# Altium schematic sheet 2414-SPB7_Connectors.SchDoc: =SchTitle
size 276 x 198 mm; Organization: ETML-ES; Address1: Rue de Sébeillon12; Address2: CH - 1004 Lausanne; Address3: Tél. 021 316 77 77; Address4: www.etml-es.ch; SheetNumber: 3; SheetTotal: 4; Replace: .; ModA: .; ModB: .; ModC: .; ModD: .
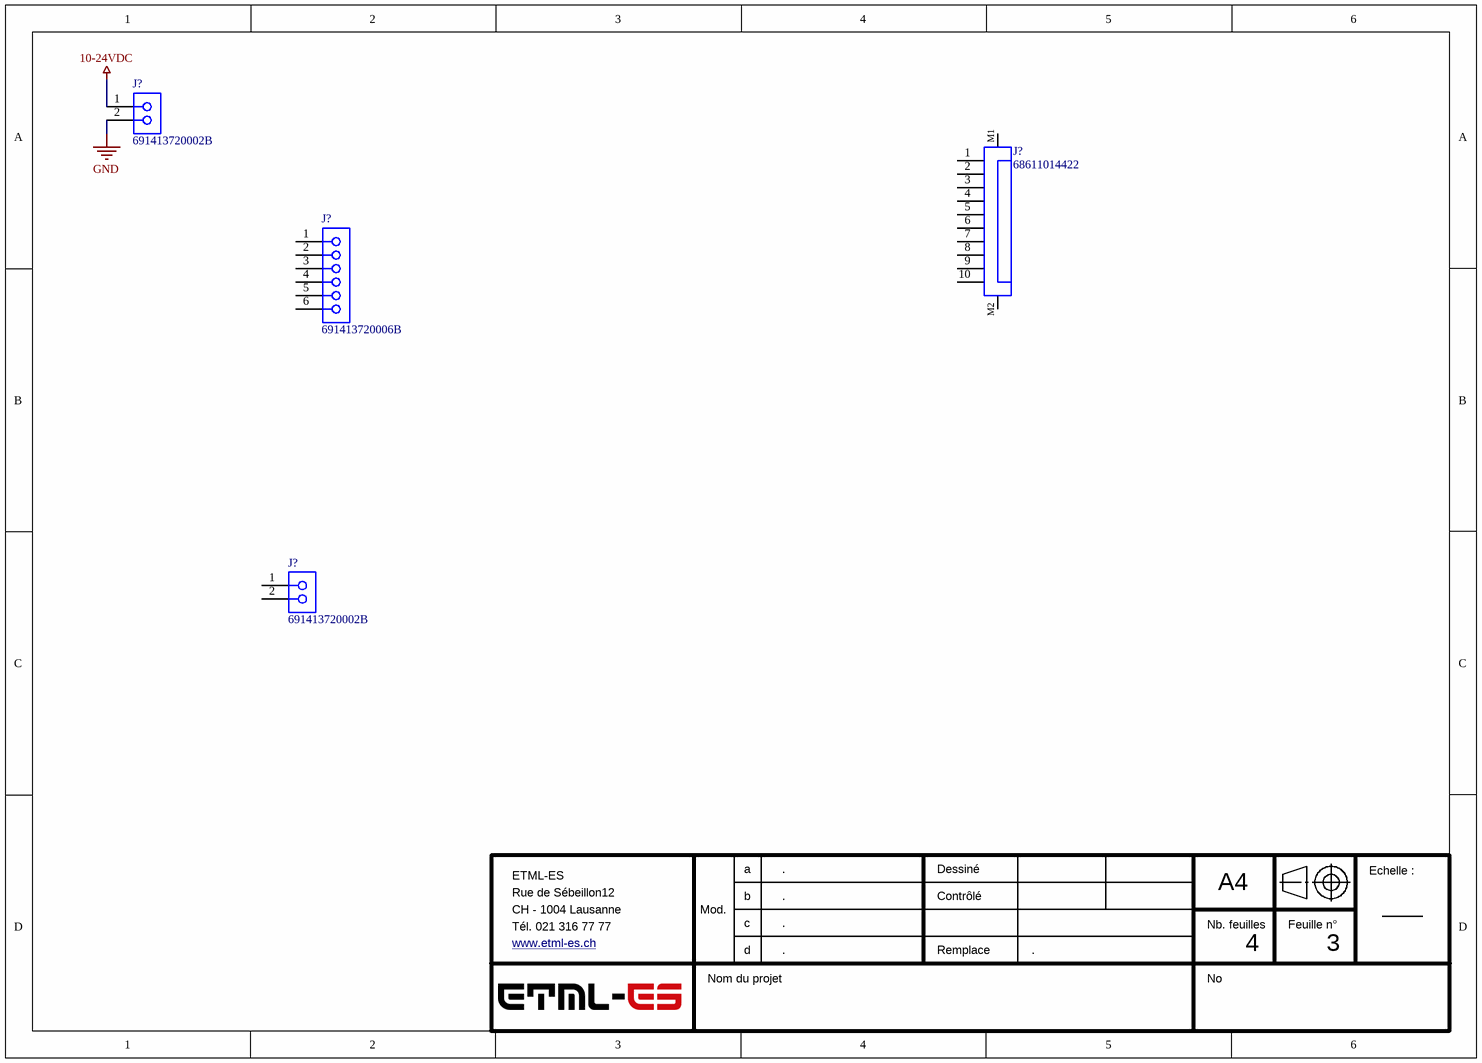
[diagram p0: 2414-SPB7_Connectors.SchDoc]

## Parts
(Parts that share a designator on the sheet are numbered #1, #2 ... from top to bottom, then left to right.)
J?#1  691413720002B  [691413720002B]
J?#2  68611014422  [68611014422]
J?#3  691413720006B  [691413720006B]
J?#4  691413720002B  [691413720002B]

## Nets
10-24VDC: J?#1.1
GND: J?#1.2

Not connected (* = marked no-connect by the designer): J?#2 1 2 3 4 5 6 7 8 9 10 M1 M2; J?#3 1 2 3 4 5 6; J?#4 1 2

## Notes on the sheet
- a
- Dessiné
- A4
- Echelle :
- Mod.
- b
- c
- d
- Contrôlé
- Remplace
- Nb. feuilles
- Feuille n°
- Nom du projet
- No

## Library data of the parts
J?#1 J?#4 = CMP-1502-03049-2: NexarPartId: 106069291
J?#2 = CMP-1502-01457-2: NexarPartId: 8917674; Actuator Material: Polyphenylene; Current Rating: 1A; Operating Supply Voltage: 125V; Contact Resistance: 20mΩ; Number of Positions: 10; Pitch: 1mm; Insulation Resistance: 100MΩ; Gender: Male; RoHS: Compliant; Max Operating Temperature: 85°C; Length: 17mm; Contact Plating: Tin; Housing Material: Polyphenylene; Contact Material: Bronze, Tin; Voltage Rating: 125V; Flammability Rating: UL94 V-0; Termination: Solder; Lead Pitch: 1mm; Min Operating Temperature: -25°C; Orientation: Horizontal; Number of Rows: 1; Packaging: Tape and Reel; Mount: Surface Mount; Number of Pins: 10; REACH SVHC: Unknown; Number of Contacts: 10; Width: 3mm
J?#3 = CMP-1502-03053-2: NexarPartId: 106069295